# EAGLE design dx10lm1-14se-to-ml-14p (EAGLE 9.1.0)
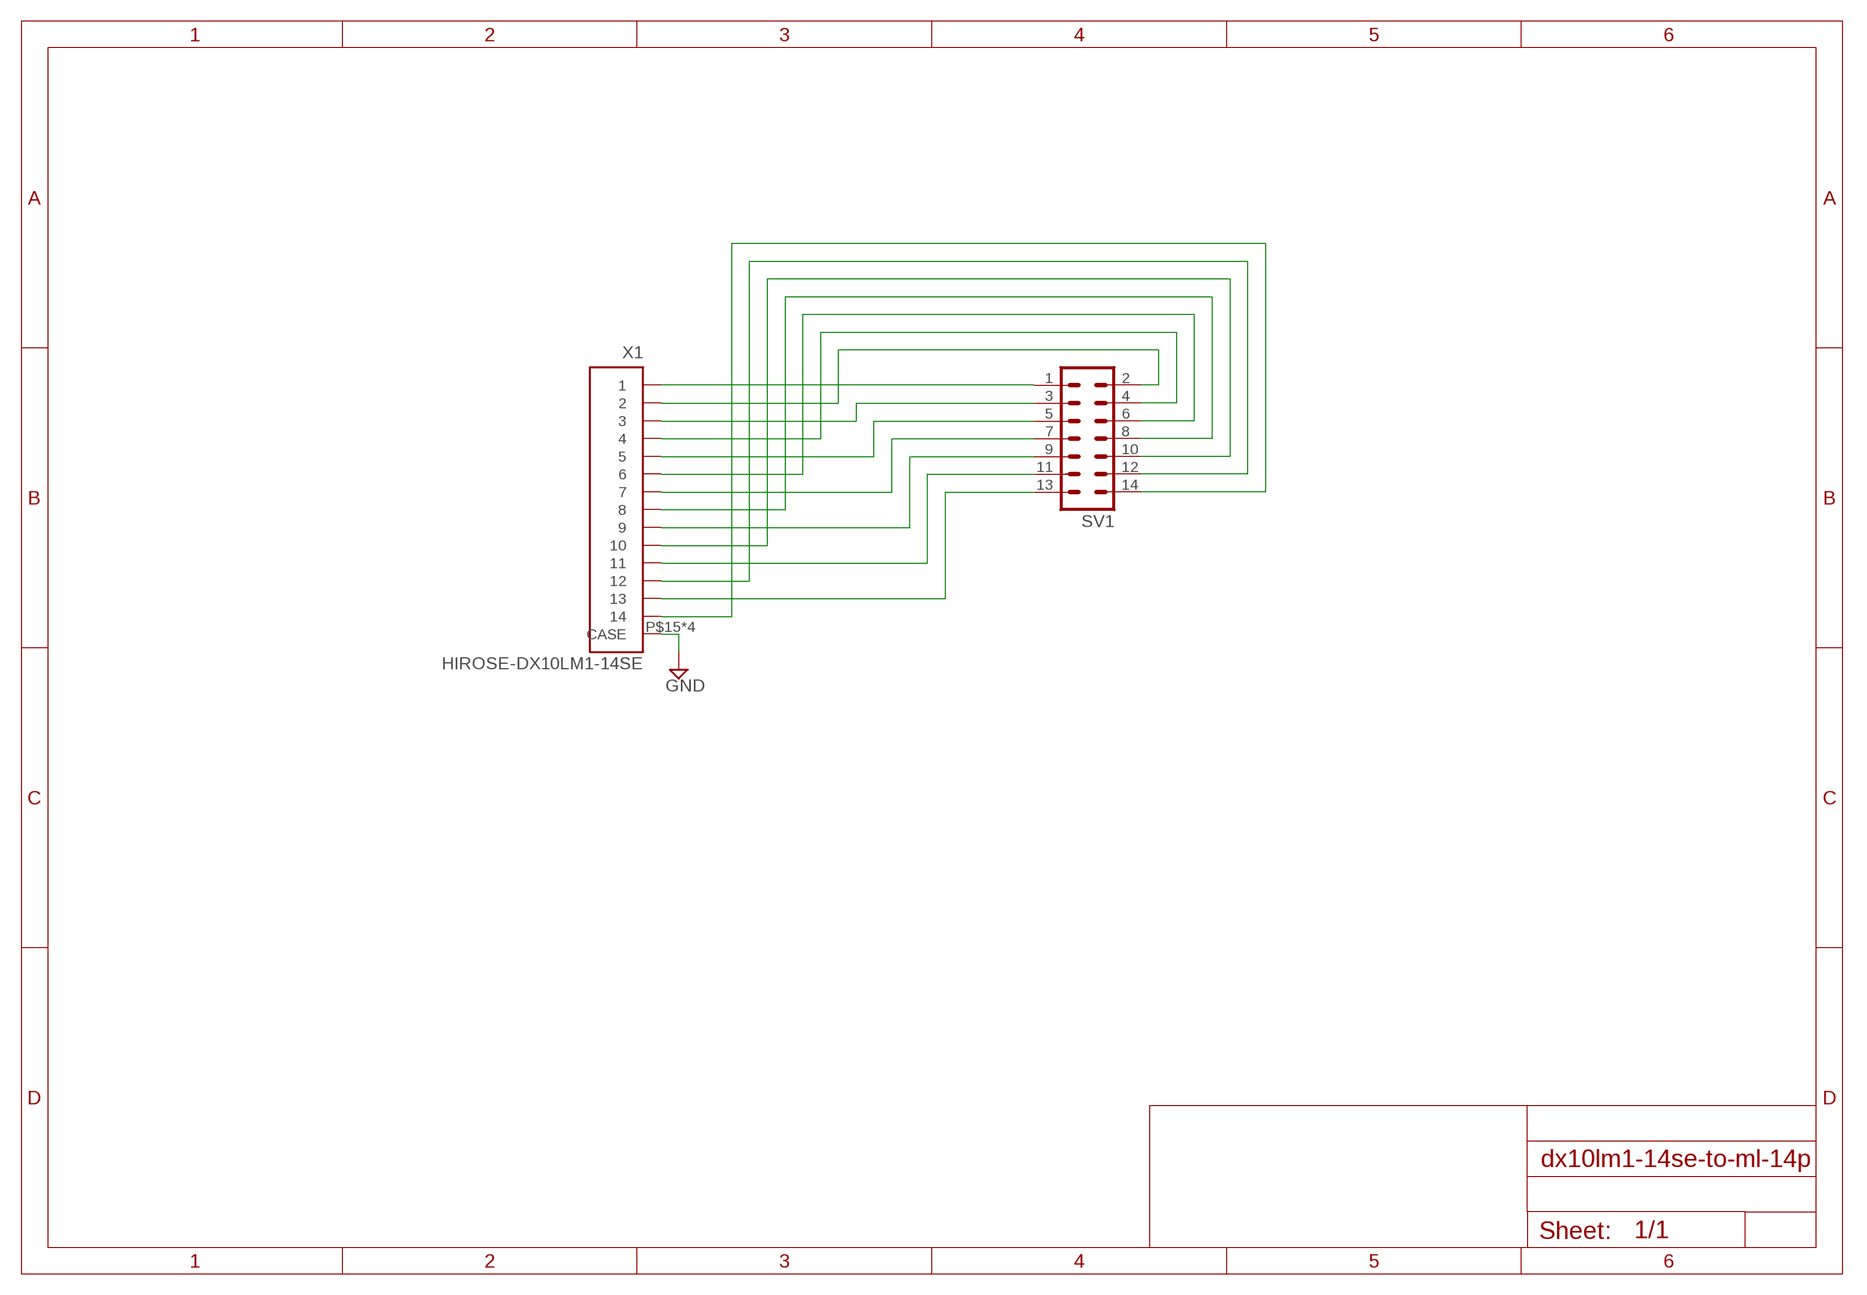
[diagram p0: schematic, sheet 1]

## Parts
SV1  ML14L  [ML14L]
X1  HIROSE-DX10LM1-14SE  [HIROSE-DX10LM1-14SE]

## Nets
GND: X1.P$15(CASE) X1.P$16(CASE) X1.P$17(CASE) X1.P$18(CASE)
N$1: SV1.1 X1.P$1
N$2: SV1.3 X1.P$3
N$3: SV1.5 X1.P$5
N$4: SV1.7 X1.P$7
N$5: SV1.9 X1.P$9
N$6: SV1.11 X1.P$11
N$7: SV1.13 X1.P$13
N$8: SV1.2 X1.P$2
N$9: SV1.4 X1.P$4
N$10: SV1.6 X1.P$6
N$11: SV1.8 X1.P$8
N$12: SV1.10 X1.P$10
N$13: SV1.12 X1.P$12
N$14: SV1.14 X1.P$14

## Library data of the parts
SV1 = con-ml:ML14L: HARTING; OC_FARNELL: unknown; OC_NEWARK: unknown
X1 = con-hirose-dx10lm1-14se:HIROSE-DX10LM1-14SE: HIROSE DX10LM1-14SE

## Net classes
0 default: width 0.61 mm, drill 0.152 mm, clearance 0.152 mm

## Board
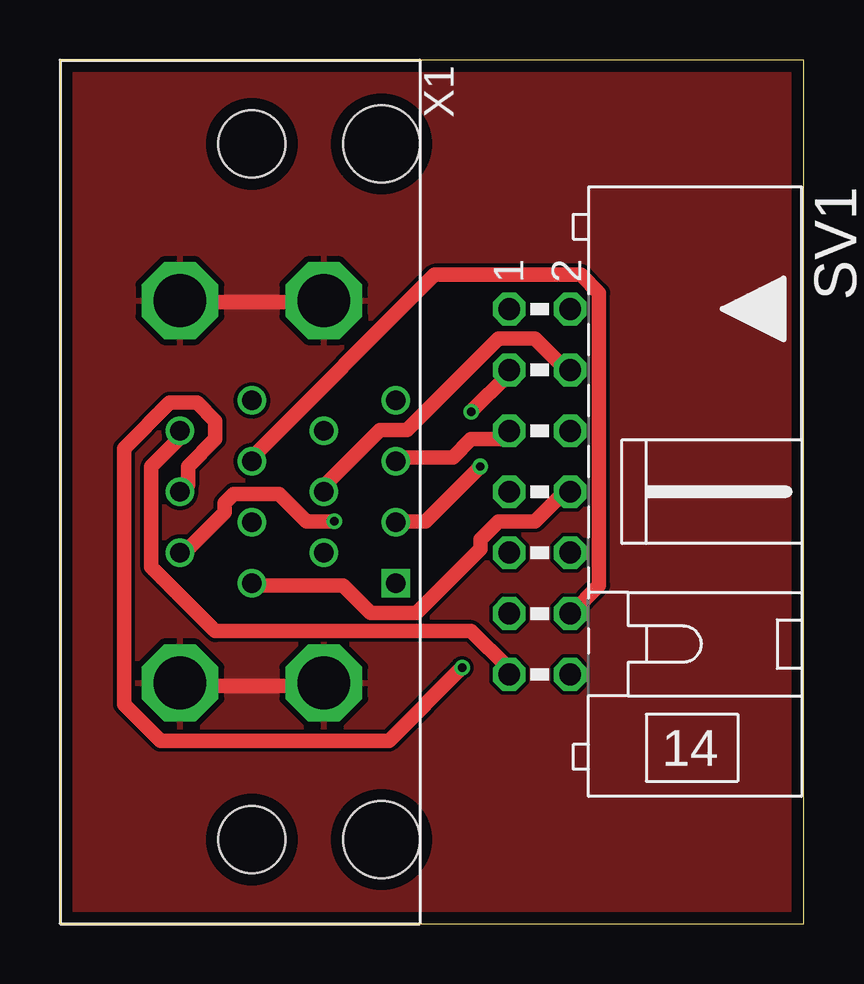
[diagram p1: board, top side]
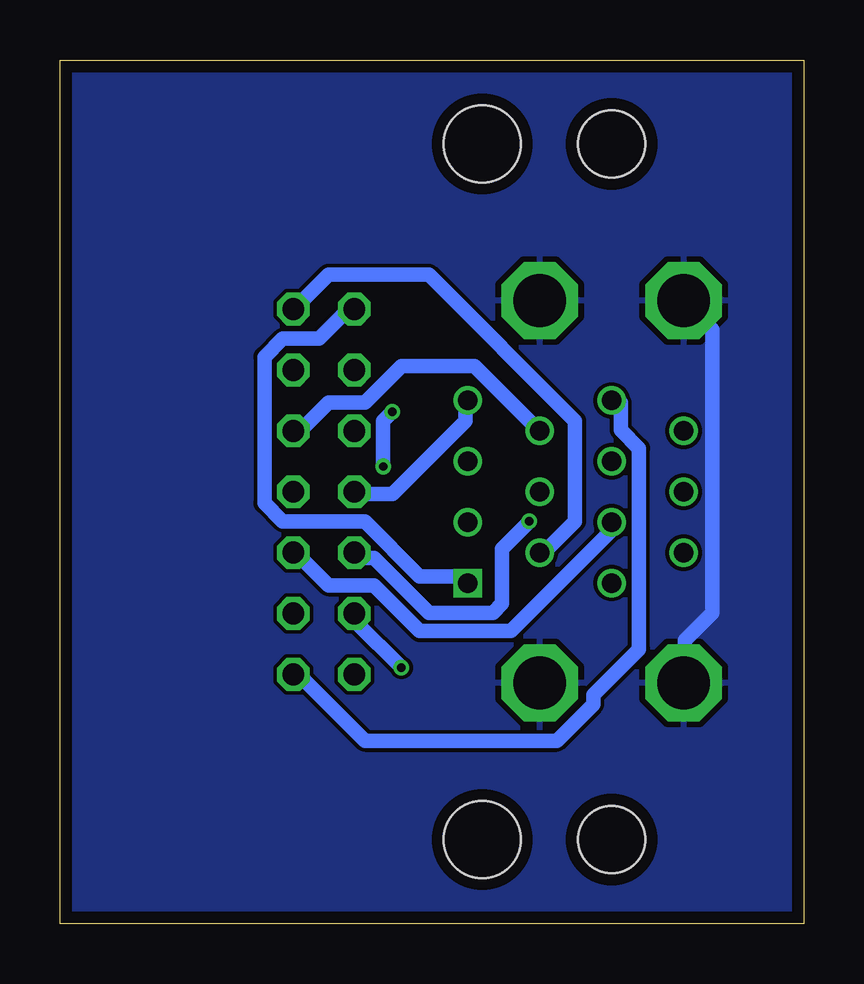
[diagram p2: board, bottom side, seen from below]

Size 31 x 36 mm. Coordinates in mm from the lower left corner, seen from the top.
Outline: 0,0 31,0 31,36 0,36 0,0
Copper layers (1*16): Top 0.035mm / dielectric 1.53mm / Bottom 0.035mm
Design rules "pban_5mil-l2": minimum track width 5mil, minimum drill 0.3mm, track to track 5mil, track to pad 0.229mm, pad to pad 5mil, via to via 5mil, smd to smd 5mil, copper to edge 0.5mm, drill to drill 0.5mm, minimum pad ring 0.15mm, minimum via ring 0.15mm, stop-mask expansion 4mil, vias tented up to drill 0.35mm, thermal gap 10mil

### Footprints (pad centres in the part's own frame; a part is rotated, then mirrored left to right if it is on the bottom)
ML14L = drill 0.914 octagon: 1 -7.62,-1.27; 2 -7.62,1.27; 3 -5.08,-1.27; 4 -5.08,1.27; 5 -2.54,-1.27; 6 -2.54,1.27; 7 0,-1.27; 8 0,1.27; 9 2.54,-1.27; 10 2.54,1.27; 11 5.08,-1.27; 12 5.08,1.27; 13 7.62,-1.27; 14 7.62,1.27
HIROSE-DX10LM1-14SE = drill 0.8 square: P$1 3.81,9 | drill 0.8: P$2 2.54,6; P$3 1.27,9; P$4 0,6; P$5 -1.27,9; P$6 -2.54,6; P$7 -3.81,9; P$8 3.81,3; P$9 2.54,0; P$10 1.27,3; P$11 0,0; P$12 -1.27,3; P$13 -2.54,0; P$14 -3.81,3 | drill 2.2 octagon: P$15 -7.97,0; P$16 7.97,0; P$17 7.97,6; P$18 -7.97,6 | hole 2.8: -14.5,3; 14.5,3 | hole 3.2: -14.5,8.4; 14.5,8.4

### Placement (x,y rotation side)
SV1  20,18 270 top
X1  5,18 270 top

### Tracks (layer width: path | path; a pad name or v marks a point on that pad's centre or on a via)
GND
  Top 0.61: X1.P$16 5.33,9.91 10.67,9.91 X1.P$17 | X1.P$15 5.33,25.91 10.67,25.91 X1.P$18
  Bottom 0.61: X1.P$16 4.95,10.29 4.95,11.81 3.81,12.95 3.81,24.77 4.95,25.91 X1.P$15
  pour Top: -1,-1 32,-1 32,37 -1,37
  pour Bottom: -2,-2 33,-2 33,38 -2,38
N$1
  Bottom 0.61: X1.P$1 14.1,14.48 16,14.48 18.29,16.76 21.72,16.76 22.48,17.53 22.48,23.62 21.72,24.38 20.19,24.38 19.05,25.53 SV1.1
N$2  (via drill 0.35)
  Top 0.61: v17.53,19.05 15.24,16.76 14.1,16.76 X1.P$3 | v17.14,21.34 18.67,22.86 SV1.3
  Bottom 0.61: v17.53,19.05 17.53,20.95 v17.14,21.34
N$3
  Top 0.61: X1.P$5 14.1,19.43 16.38,19.43 17.14,20.19 18.67,20.19 SV1.5
N$4
  Bottom 0.61: X1.P$7 14.1,21.72 14.1,20.95 17.14,17.91 18.67,17.91 SV1.7
N$5  (via drill 0.35)
  Top 0.61: v11.43,16.76 10.29,16.76 9.14,17.91 7.24,17.91 6.86,17.53 6.86,17.14 5.33,15.62 X1.P$9
  Bottom 0.61: v11.43,16.76 12.57,15.62 12.57,13.34 12.95,12.95 15.62,12.95 17.91,15.24 18.67,15.24 SV1.9
N$6  (via drill 0.35)
  Top 0.61: v16.76,10.67 13.72,7.62 4.19,7.62 2.67,9.14 2.67,19.81 4.57,21.72 5.71,21.72 6.48,20.95 6.48,20.19 5.33,19.05 5.33,18.29 X1.P$11
  Bottom 0.61: v16.76,10.67 18.67,12.57 SV1.11
N$7
  Top 0.61: X1.P$13 4.95,20.19 3.81,19.05 3.81,14.86 6.48,12.19 17.14,12.19 18.67,10.67 SV1.13
N$8
  Bottom 0.61: X1.P$2 10.67,15.62 9.53,16.76 9.53,20.95 15.62,27.05 19.81,27.05 20.95,25.91 SV1.2
N$9
  Top 0.61: X1.P$4 11.05,18.29 13.34,20.57 14.48,20.57 18.29,24.38 19.81,24.38 20.95,23.24 SV1.4
N$10
  Bottom 0.61: X1.P$6 11.05,20.57 13.72,23.24 16.76,23.24 18.29,21.72 19.81,21.72 20.95,20.57 SV1.6
N$11
  Top 0.61: X1.P$8 8,14.1 11.81,14.1 12.95,12.95 14.86,12.95 17.53,15.62 17.53,16 18.29,16.76 19.81,16.76 20.95,17.91 SV1.8
N$12
  Bottom 0.61: X1.P$10 8,16.38 12.19,12.19 16,12.19 17.91,14.1 19.81,14.1 20.95,15.24 SV1.10
N$13
  Top 0.61: X1.P$12 8,19.43 15.62,27.05 21.72,27.05 22.48,26.29 22.48,14.1 21.34,12.95 SV1.12
N$14
  Bottom 0.61: X1.P$14 7.62,21.72 7.62,20.57 6.86,19.81 6.86,11.43 8.76,9.53 8.76,9.14 10.29,7.62 18.29,7.62 20.95,10.29 SV1.14